# Altium schematic sheet RbMotor_ECAT_RevB+.SchDoc
size 297 x 209 mm
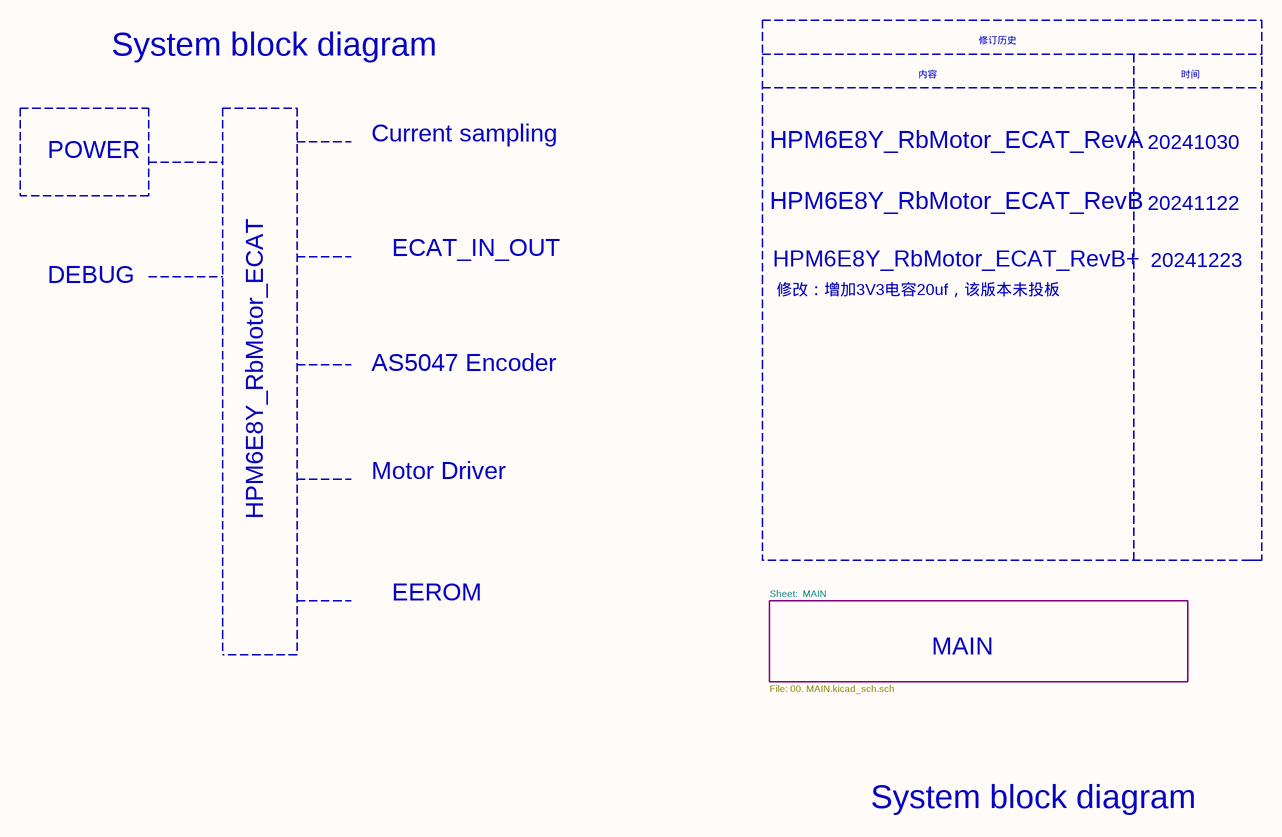
[diagram p0: RbMotor_ECAT_RevB+.SchDoc]

## Sub-sheets
 MAIN = 00. MAIN.SchDoc: no entries

## Notes on the sheet
- System block diagram
- 内容
- 修订历史
- 时间
- POWER
- Current sampling
- HPM6E8Y_RbMotor_ECAT_RevA
- 20241030
- HPM6E8Y_RbMotor_ECAT_RevB
- 20241122
- DEBUG
- ECAT_IN_OUT
- HPM6E8Y_RbMotor_ECAT_RevB+
- 修改：增加3V3电容20uf，该版本未投板
- 20241223
- AS5047 Encoder
- Motor Driver
- HPM6E8Y_RbMotor_ECAT
- EEROM
- Sheet:  MAIN
- File: 00. MAIN.kicad_sch.sch
- MAIN
- 1
- 2
- 3
- 4
- 5
- 6
- A
- B
- C
- D
- Title: HPM6E8Y_RbMotor_ECAT
- File: RbMotor_ECAT_RevB+.kicad_sch
- Sheet: /
- KiCad E.D.A.  kicad (5.1.4)-1
- Size: A4
- Date: 2024-11-21
- Rev: RevB+
- Id: 1/1